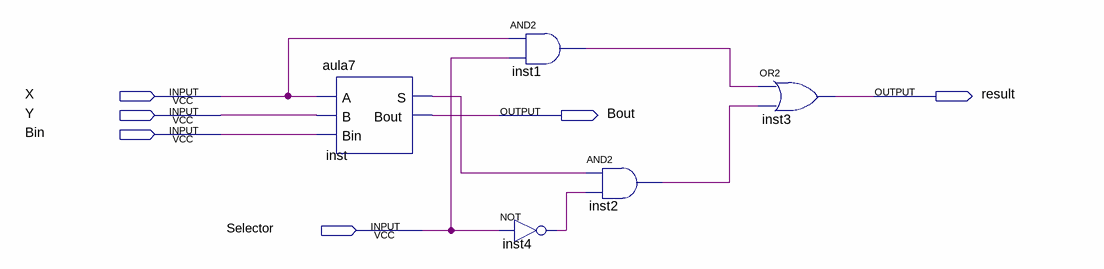
[diagram p0: schematic sheet]
// Quartus schematic Divisor.bdf as structural Verilog: 5 symbols, 6 pins
module Divisor (
  input  X,
  input  Y,
  input  Bin,
  input  Selector,
  output result,
  output Bout
);

  wire inst1_out, inst2_out, inst4_out, inst_s;

  aula7 inst (.A(X), .B(Y), .Bin(Bin), .S(inst_s), .Bout(Bout));
  and inst1 (inst1_out, X, Selector);
  not inst4 (inst4_out, Selector);
  and inst2 (inst2_out, inst_s, inst4_out);
  or inst3 (result, inst1_out, inst2_out);
endmodule
